# Altium schematic sheet CPU_CORE1.SchDoc
size 508 x 304 mm; SheetNumber: 1; SheetTotal: 6
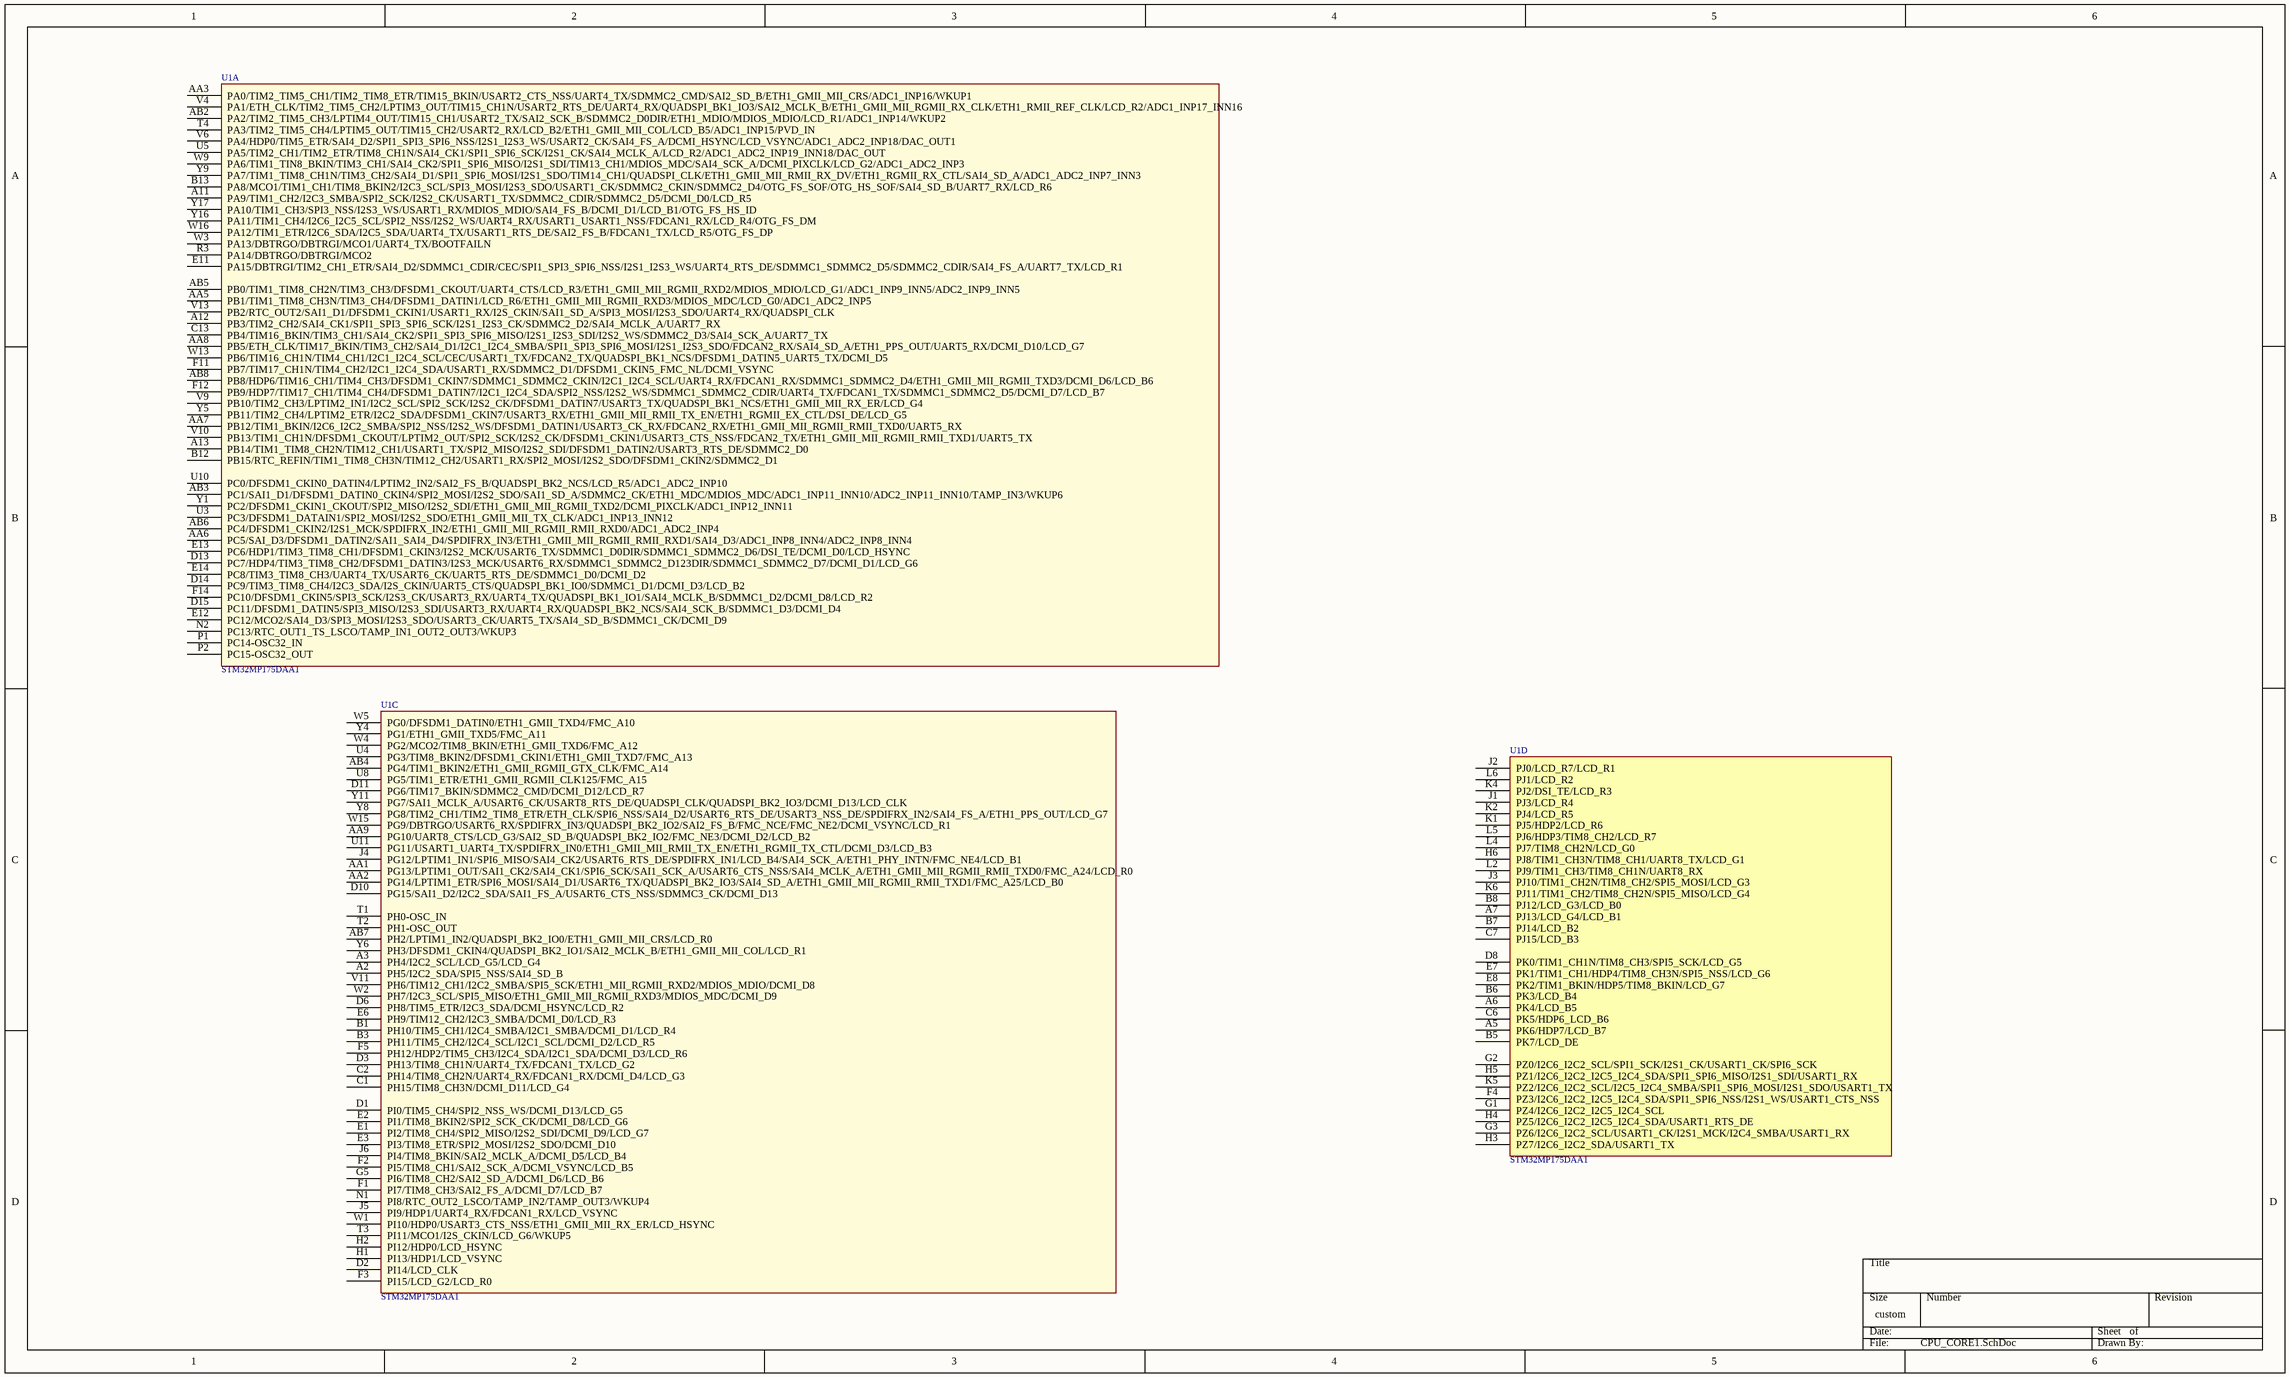
[diagram p0: CPU_CORE1.SchDoc]

## Parts
U1  STM32MP175DAA1  [LFBGA448]  (parts A,C,D of 7)

## Nets

Not connected (* = marked no-connect by the designer): U1 A2(PH5/I2C2_SDA/SPI5_NSS/SAI4_SD_B) A3(PH4/I2C2_SCL/LCD_G5/LCD_G4) A5(PK6/HDP7/LCD_B7) A6(PK4/LCD_B5) A7(PJ13/LCD_G4/LCD_B1) A11(PA9/TIM1_CH2/I2C3_SMBA/SPI2_SCK/I2S2_CK/USART1_TX/SDMMC2_CDIR/SDMMC2_D5/DCMI_D0/LCD_R5) A12(PB3/TIM2_CH2/SAI4_CK1/SPI1_SPI3_SPI6_SCK/I2S1_I2S3_CK/SDMMC2_D2/SAI4_MCLK_A/UART7_RX) A13(PB14/TIM1_TIM8_CH2N/TIM12_CH1/USART1_TX/SPI2_MISO/I2S2_SDI/DFSDM1_DATIN2/USART3_RTS_DE/SDMMC2_D0) AA1(PG13/LPTIM1_OUT/SAI1_CK2/SAI4_CK1/SPI6_SCK/SAI1_SCK_A/USART6_CTS_NSS/SAI4_MCLK_A/ETH1_GMII_MII_RGMII_RMII_TXD0/FMC_A24/LCD_R0) AA2(PG14/LPTIM1_ETR/SPI6_MOSI/SAI4_D1/USART6_TX/QUADSPI_BK2_IO3/SAI4_SD_A/ETH1_GMII_MII_RGMII_RMII_TXD1/FMC_A25/LCD_B0) AA3(PA0/TIM2_TIM5_CH1/TIM2_TIM8_ETR/TIM15_BKIN/USART2_CTS_NSS/UART4_TX/SDMMC2_CMD/SAI2_SD_B/ETH1_GMII_MII_CRS/ADC1_INP16/WKUP1) AA5(PB1/TIM1_TIM8_CH3N/TIM3_CH4/DFSDM1_DATIN1/LCD_R6/ETH1_GMII_MII_RGMII_RXD3/MDIOS_MDC/LCD_G0/ADC1_ADC2_INP5) AA6(PC5/SAI_D3/DFSDM1_DATIN2/SAI1_SAI4_D4/SPDIFRX_IN3/ETH1_GMII_MII_RGMII_RMII_RXD1/SAI4_D3/ADC1_INP8_INN4/ADC2_INP8_INN4) AA7(PB12/TIM1_BKIN/I2C6_I2C2_SMBA/SPI2_NSS/I2S2_WS/DFSDM1_DATIN1/USART3_CK_RX/FDCAN2_RX/ETH1_GMII_MII_RGMII_RMII_TXD0/UART5_RX) AA8(PB5/ETH_CLK/TIM17_BKIN/TIM3_CH2/SAI4_D1/I2C1_I2C4_SMBA/SPI1_SPI3_SPI6_MOSI/I2S1_I2S3_SDO/FDCAN2_RX/SAI4_SD_A/ETH1_PPS_OUT/UART5_RX/DCMI_D10/LCD_G7) AA9(PG10/UART8_CTS/LCD_G3/SAI2_SD_B/QUADSPI_BK2_IO2/FMC_NE3/DCMI_D2/LCD_B2) AB2(PA2/TIM2_TIM5_CH3/LPTIM4_OUT/TIM15_CH1/USART2_TX/SAI2_SCK_B/SDMMC2_D0DIR/ETH1_MDIO/MDIOS_MDIO/LCD_R1/ADC1_INP14/WKUP2) AB3(PC1/SAI1_D1/DFSDM1_DATIN0_CKIN4/SPI2_MOSI/I2S2_SDO/SAI1_SD_A/SDMMC2_CK/ETH1_MDC/MDIOS_MDC/ADC1_INP11_INN10/ADC2_INP11_INN10/TAMP_IN3/WKUP6) AB4(PG4/TIM1_BKIN2/ETH1_GMII_RGMII_GTX_CLK/FMC_A14) AB5(PB0/TIM1_TIM8_CH2N/TIM3_CH3/DFSDM1_CKOUT/UART4_CTS/LCD_R3/ETH1_GMII_MII_RGMII_RXD2/MDIOS_MDIO/LCD_G1/ADC1_INP9_INN5/ADC2_INP9_INN5) AB6(PC4/DFSDM1_CKIN2/I2S1_MCK/SPDIFRX_IN2/ETH1_GMII_MII_RGMII_RMII_RXD0/ADC1_ADC2_INP4) AB7(PH2/LPTIM1_IN2/QUADSPI_BK2_IO0/ETH1_GMII_MII_CRS/LCD_R0) AB8(PB8/HDP6/TIM16_CH1/TIM4_CH3/DFSDM1_CKIN7/SDMMC1_SDMMC2_CKIN/I2C1_I2C4_SCL/UART4_RX/FDCAN1_RX/SDMMC1_SDMMC2_D4/ETH1_GMII_MII_RGMII_TXD3/DCMI_D6/LCD_B6) B1(PH10/TIM5_CH1/I2C4_SMBA/I2C1_SMBA/DCMI_D1/LCD_R4) B3(PH11/TIM5_CH2/I2C4_SCL/I2C1_SCL/DCMI_D2/LCD_R5) B5(PK7/LCD_DE) B6(PK3/LCD_B4) B7(PJ14/LCD_B2) B8(PJ12/LCD_G3/LCD_B0) B12(PB15/RTC_REFIN/TIM1_TIM8_CH3N/TIM12_CH2/USART1_RX/SPI2_MOSI/I2S2_SDO/DFSDM1_CKIN2/SDMMC2_D1) B13(PA8/MCO1/TIM1_CH1/TIM8_BKIN2/I2C3_SCL/SPI3_MOSI/I2S3_SDO/USART1_CK/SDMMC2_CKIN/SDMMC2_D4/OTG_FS_SOF/OTG_HS_SOF/SAI4_SD_B/UART7_RX/LCD_R6) C1(PH15/TIM8_CH3N/DCMI_D11/LCD_G4) C2(PH14/TIM8_CH2N/UART4_RX/FDCAN1_RX/DCMI_D4/LCD_G3) C6(PK5/HDP6_LCD_B6) C7(PJ15/LCD_B3) C13(PB4/TIM16_BKIN/TIM3_CH1/SAI4_CK2/SPI1_SPI3_SPI6_MISO/I2S1_I2S3_SDI/I2S2_WS/SDMMC2_D3/SAI4_SCK_A/UART7_TX) D1(PI0/TIM5_CH4/SPI2_NSS_WS/DCMI_D13/LCD_G5) D2(PI14/LCD_CLK) D3(PH13/TIM8_CH1N/UART4_TX/FDCAN1_TX/LCD_G2) D6(PH8/TIM5_ETR/I2C3_SDA/DCMI_HSYNC/LCD_R2) D8(PK0/TIM1_CH1N/TIM8_CH3/SPI5_SCK/LCD_G5) D10(PG15/SAI1_D2/I2C2_SDA/SAI1_FS_A/USART6_CTS_NSS/SDMMC3_CK/DCMI_D13) D11(PG6/TIM17_BKIN/SDMMC2_CMD/DCMI_D12/LCD_R7) D13(PC7/HDP4/TIM3_TIM8_CH2/DFSDM1_DATIN3/I2S3_MCK/USART6_RX/SDMMC1_SDMMC2_D123DIR/SDMMC1_SDMMC2_D7/DCMI_D1/LCD_G6) D14(PC9/TIM3_TIM8_CH4/I2C3_SDA/I2S_CKIN/UART5_CTS/QUADSPI_BK1_IO0/SDMMC1_D1/DCMI_D3/LCD_B2) D15(PC11/DFSDM1_DATIN5/SPI3_MISO/I2S3_SDI/USART3_RX/UART4_RX/QUADSPI_BK2_NCS/SAI4_SCK_B/SDMMC1_D3/DCMI_D4) E1(PI2/TIM8_CH4/SPI2_MISO/I2S2_SDI/DCMI_D9/LCD_G7) E2(PI1/TIM8_BKIN2/SPI2_SCK_CK/DCMI_D8/LCD_G6) E3(PI3/TIM8_ETR/SPI2_MOSI/I2S2_SDO/DCMI_D10) E6(PH9/TIM12_CH2/I2C3_SMBA/DCMI_D0/LCD_R3) E7(PK1/TIM1_CH1/HDP4/TIM8_CH3N/SPI5_NSS/LCD_G6) E8(PK2/TIM1_BKIN/HDP5/TIM8_BKIN/LCD_G7) E11(PA15/DBTRGI/TIM2_CH1_ETR/SAI4_D2/SDMMC1_CDIR/CEC/SPI1_SPI3_SPI6_NSS/I2S1_I2S3_WS/UART4_RTS_DE/SDMMC1_SDMMC2_D5/SDMMC2_CDIR/SAI4_FS_A/UART7_TX/LCD_R1) E12(PC12/MCO2/SAI4_D3/SPI3_MOSI/I2S3_SDO/USART3_CK/UART5_TX/SAI4_SD_B/SDMMC1_CK/DCMI_D9) E13(PC6/HDP1/TIM3_TIM8_CH1/DFSDM1_CKIN3/I2S2_MCK/USART6_TX/SDMMC1_D0DIR/SDMMC1_SDMMC2_D6/DSI_TE/DCMI_D0/LCD_HSYNC) E14(PC8/TIM3_TIM8_CH3/UART4_TX/USART6_CK/UART5_RTS_DE/SDMMC1_D0/DCMI_D2) F1(PI7/TIM8_CH3/SAI2_FS_A/DCMI_D7/LCD_B7) F2(PI5/TIM8_CH1/SAI2_SCK_A/DCMI_VSYNC/LCD_B5) F3(PI15/LCD_G2/LCD_R0) F4(PZ3/I2C6_I2C2_I2C5_I2C4_SDA/SPI1_SPI6_NSS/I2S1_WS/USART1_CTS_NSS) F5(PH12/HDP2/TIM5_CH3/I2C4_SDA/I2C1_SDA/DCMI_D3/LCD_R6) F11(PB7/TIM17_CH1N/TIM4_CH2/I2C1_I2C4_SDA/USART1_RX/SDMMC2_D1/DFSDM1_CKIN5_FMC_NL/DCMI_VSYNC) F12(PB9/HDP7/TIM17_CH1/TIM4_CH4/DFSDM1_DATIN7/I2C1_I2C4_SDA/SPI2_NSS/I2S2_WS/SDMMC1_SDMMC2_CDIR/UART4_TX/FDCAN1_TX/SDMMC1_SDMMC2_D5/DCMI_D7/LCD_B7) F14(PC10/DFSDM1_CKIN5/SPI3_SCK/I2S3_CK/USART3_RX/UART4_TX/QUADSPI_BK1_IO1/SAI4_MCLK_B/SDMMC1_D2/DCMI_D8/LCD_R2) G1(PZ4/I2C6_I2C2_I2C5_I2C4_SCL) G2(PZ0/I2C6_I2C2_SCL/SPI1_SCK/I2S1_CK/USART1_CK/SPI6_SCK) G3(PZ6/I2C6_I2C2_SCL/USART1_CK/I2S1_MCK/I2C4_SMBA/USART1_RX) G5(PI6/TIM8_CH2/SAI2_SD_A/DCMI_D6/LCD_B6) H1(PI13/HDP1/LCD_VSYNC) H2(PI12/HDP0/LCD_HSYNC) H3(PZ7/I2C6_I2C2_SDA/USART1_TX) H4(PZ5/I2C6_I2C2_I2C5_I2C4_SDA/USART1_RTS_DE) H5(PZ1/I2C6_I2C2_I2C5_I2C4_SDA/SPI1_SPI6_MISO/I2S1_SDI/USART1_RX) H6(PJ8/TIM1_CH3N/TIM8_CH1/UART8_TX/LCD_G1) J1(PJ3/LCD_R4) J2(PJ0/LCD_R7/LCD_R1) J3(PJ10/TIM1_CH2N/TIM8_CH2/SPI5_MOSI/LCD_G3) J4(PG12/LPTIM1_IN1/SPI6_MISO/SAI4_CK2/USART6_RTS_DE/SPDIFRX_IN1/LCD_B4/SAI4_SCK_A/ETH1_PHY_INTN/FMC_NE4/LCD_B1) J5(PI9/HDP1/UART4_RX/FDCAN1_RX/LCD_VSYNC) J6(PI4/TIM8_BKIN/SAI2_MCLK_A/DCMI_D5/LCD_B4) K1(PJ5/HDP2/LCD_R6) K2(PJ4/LCD_R5) K4(PJ2/DSI_TE/LCD_R3) K5(PZ2/I2C6_I2C2_SCL/I2C5_I2C4_SMBA/SPI1_SPI6_MOSI/I2S1_SDO/USART1_TX) K6(PJ11/TIM1_CH2/TIM8_CH2N/SPI5_MISO/LCD_G4) L2(PJ9/TIM1_CH3/TIM8_CH1N/UART8_RX) L4(PJ7/TIM8_CH2N/LCD_G0) L5(PJ6/HDP3/TIM8_CH2/LCD_R7) L6(PJ1/LCD_R2) N1(PI8/RTC_OUT2_LSCO/TAMP_IN2/TAMP_OUT3/WKUP4) N2(PC13/RTC_OUT1_TS_LSCO/TAMP_IN1_OUT2_OUT3/WKUP3) P1(PC14-OSC32_IN) P2(PC15-OSC32_OUT) R3(PA14/DBTRGO/DBTRGI/MCO2) T1(PH0-OSC_IN) T2(PH1-OSC_OUT) T3(PI11/MCO1/I2S_CKIN/LCD_G6/WKUP5) T4(PA3/TIM2_TIM5_CH4/LPTIM5_OUT/TIM15_CH2/USART2_RX/LCD_B2/ETH1_GMII_MII_COL/LCD_B5/ADC1_INP15/PVD_IN) U3(PC3/DFSDM1_DATAIN1/SPI2_MOSI/I2S2_SDO/ETH1_GMII_MII_TX_CLK/ADC1_INP13_INN12) U4(PG3/TIM8_BKIN2/DFSDM1_CKIN1/ETH1_GMII_TXD7/FMC_A13) U5(PA5/TIM2_CH1/TIM2_ETR/TIM8_CH1N/SAI4_CK1/SPI1_SPI6_SCK/I2S1_CK/SAI4_MCLK_A/LCD_R2/ADC1_ADC2_INP19_INN18/DAC_OUT) U8(PG5/TIM1_ETR/ETH1_GMII_RGMII_CLK125/FMC_A15) U10(PC0/DFSDM1_CKIN0_DATIN4/LPTIM2_IN2/SAI2_FS_B/QUADSPI_BK2_NCS/LCD_R5/ADC1_ADC2_INP10) U11(PG11/USART1_UART4_TX/SPDIFRX_IN0/ETH1_GMII_MII_RMII_TX_EN/ETH1_RGMII_TX_CTL/DCMI_D3/LCD_B3) V4(PA1/ETH_CLK/TIM2_TIM5_CH2/LPTIM3_OUT/TIM15_CH1N/USART2_RTS_DE/UART4_RX/QUADSPI_BK1_IO3/SAI2_MCLK_B/ETH1_GMII_MII_RGMII_RX_CLK/ETH1_RMII_REF_CLK/LCD_R2/ADC1_INP17_INN16) V6(PA4/HDP0/TIM5_ETR/SAI4_D2/SPI1_SPI3_SPI6_NSS/I2S1_I2S3_WS/USART2_CK/SAI4_FS_A/DCMI_HSYNC/LCD_VSYNC/ADC1_ADC2_INP18/DAC_OUT1) V9(PB10/TIM2_CH3/LPTIM2_IN1/I2C2_SCL/SPI2_SCK/I2S2_CK/DFSDM1_DATIN7/USART3_TX/QUADSPI_BK1_NCS/ETH1_GMII_MII_RX_ER/LCD_G4) V10(PB13/TIM1_CH1N/DFSDM1_CKOUT/LPTIM2_OUT/SPI2_SCK/I2S2_CK/DFSDM1_CKIN1/USART3_CTS_NSS/FDCAN2_TX/ETH1_GMII_MII_RGMII_RMII_TXD1/UART5_TX) V11(PH6/TIM12_CH1/I2C2_SMBA/SPI5_SCK/ETH1_MII_RGMII_RXD2/MDIOS_MDIO/DCMI_D8) V13(PB2/RTC_OUT2/SAI1_D1/DFSDM1_CKIN1/USART1_RX/I2S_CKIN/SAI1_SD_A/SPI3_MOSI/I2S3_SDO/UART4_RX/QUADSPI_CLK) W1(PI10/HDP0/USART3_CTS_NSS/ETH1_GMII_MII_RX_ER/LCD_HSYNC) W2(PH7/I2C3_SCL/SPI5_MISO/ETH1_GMII_MII_RGMII_RXD3/MDIOS_MDC/DCMI_D9) W3(PA13/DBTRGO/DBTRGI/MCO1/UART4_TX/BOOTFAILN) W4(PG2/MCO2/TIM8_BKIN/ETH1_GMII_TXD6/FMC_A12) W5(PG0/DFSDM1_DATIN0/ETH1_GMII_TXD4/FMC_A10) W9(PA6/TIM1_TIN8_BKIN/TIM3_CH1/SAI4_CK2/SPI1_SPI6_MISO/I2S1_SDI/TIM13_CH1/MDIOS_MDC/SAI4_SCK_A/DCMI_PIXCLK/LCD_G2/ADC1_ADC2_INP3) W13(PB6/TIM16_CH1N/TIM4_CH1/I2C1_I2C4_SCL/CEC/USART1_TX/FDCAN2_TX/QUADSPI_BK1_NCS/DFSDM1_DATIN5_UART5_TX/DCMI_D5) W15(PG9/DBTRGO/USART6_RX/SPDIFRX_IN3/QUADSPI_BK2_IO2/SAI2_FS_B/FMC_NCE/FMC_NE2/DCMI_VSYNC/LCD_R1) W16(PA12/TIM1_ETR/I2C6_SDA/I2C5_SDA/UART4_TX/USART1_RTS_DE/SAI2_FS_B/FDCAN1_TX/LCD_R5/OTG_FS_DP) Y1(PC2/DFSDM1_CKIN1_CKOUT/SPI2_MISO/I2S2_SDI/ETH1_GMII_MII_RGMII_TXD2/DCMI_PIXCLK/ADC1_INP12_INN11) Y4(PG1/ETH1_GMII_TXD5/FMC_A11) Y5(PB11/TIM2_CH4/LPTIM2_ETR/I2C2_SDA/DFSDM1_CKIN7/USART3_RX/ETH1_GMII_MII_RMII_TX_EN/ETH1_RGMII_EX_CTL/DSI_DE/LCD_G5) Y6(PH3/DFSDM1_CKIN4/QUADSPI_BK2_IO1/SAI2_MCLK_B/ETH1_GMII_MII_COL/LCD_R1) Y8(PG8/TIM2_CH1/TIM2_TIM8_ETR/ETH_CLK/SPI6_NSS/SAI4_D2/USART6_RTS_DE/USART3_NSS_DE/SPDIFRX_IN2/SAI4_FS_A/ETH1_PPS_OUT/LCD_G7) Y9(PA7/TIM1_TIM8_CH1N/TIM3_CH2/SAI4_D1/SPI1_SPI6_MOSI/I2S1_SDO/TIM14_CH1/QUADSPI_CLK/ETH1_GMII_MII_RMII_RX_DV/ETH1_RGMII_RX_CTL/SAI4_SD_A/ADC1_ADC2_INP7_INN3) Y11(PG7/SAI1_MCLK_A/USART6_CK/USART8_RTS_DE/QUADSPI_CLK/QUADSPI_BK2_IO3/DCMI_D13/LCD_CLK) Y16(PA11/TIM1_CH4/I2C6_I2C5_SCL/SPI2_NSS/I2S2_WS/UART4_RX/USART1_USART1_NSS/FDCAN1_RX/LCD_R4/OTG_FS_DM) Y17(PA10/TIM1_CH3/SPI3_NSS/I2S3_WS/USART1_RX/MDIOS_MDIO/SAI4_FS_B/DCMI_D1/LCD_B1/OTG_FS_HS_ID)

## Library data of the parts
U1 = STM32MP175AAA3